# EAGLE design ball_catch_sensor_1 (EAGLE 9.6.2)
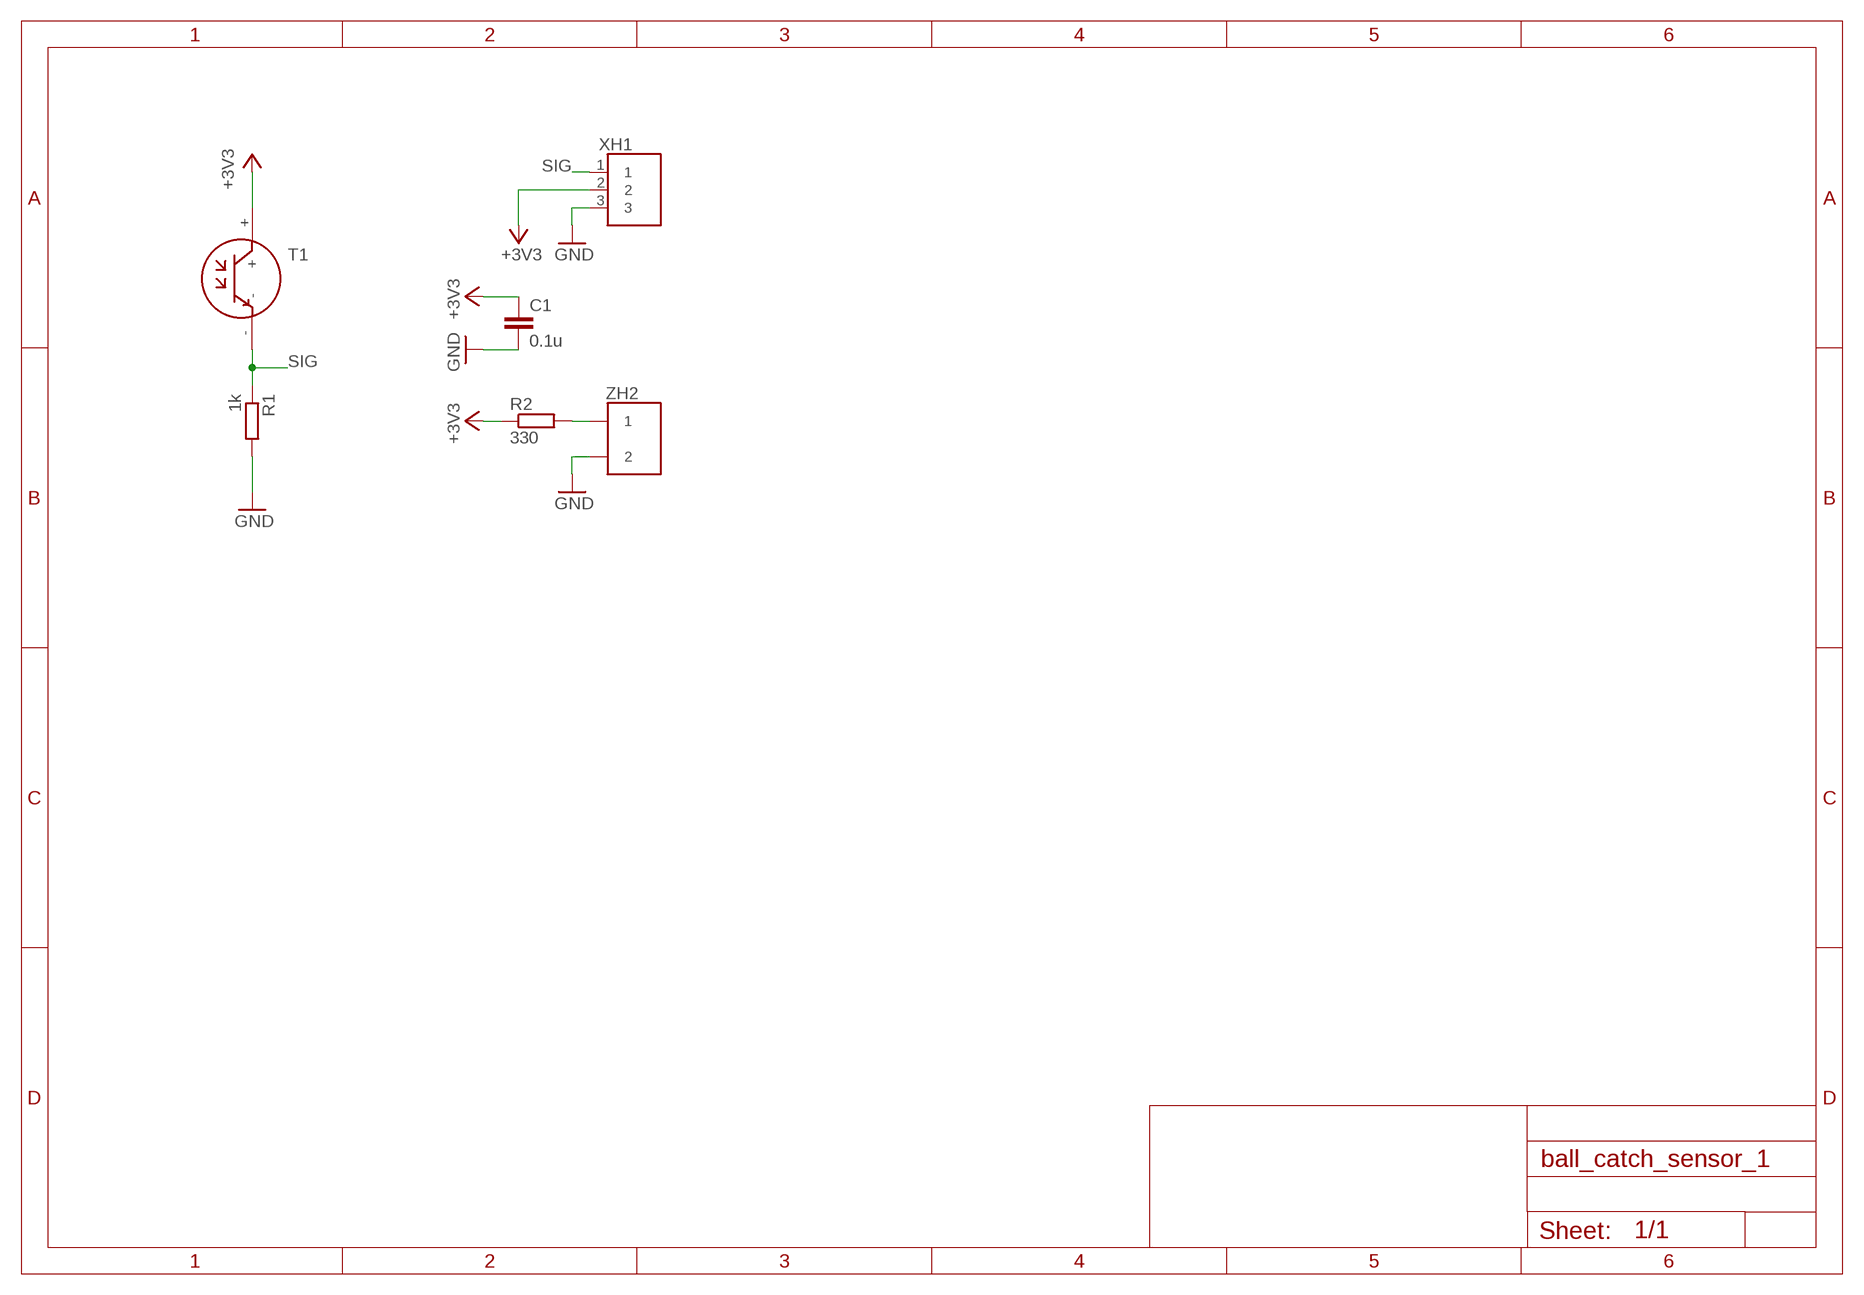
[diagram p0: schematic, sheet 1]

## Parts
C1  0.1u  C-EUC0603  [C0603]
R1  1k  R-EU_0207/10  [0207/10]
R2  330  R-EU_0207/10  [0207/10]
T1  NJL7302L-F3  [NJL7302L-F3]
XH1  S3B  [S3B]
ZH2  2B  [2B]

## Nets
+3V3: C1.1 R2.1 T1.+ XH1.2
GND: C1.2 R1.2 XH1.3 ZH2.2
N$1: R2.2 ZH2.1
SIG: R1.1 T1.- XH1.1

## Library data of the parts
C1 = rcl:C-EU: CAPACITOR, European symbol; SPICEPREFIX: C
R1 R2 = rcl:R-EU_: RESISTOR, European symbol; SPICEPREFIX: R
T1 = NJL7302L-F3:NJL7302L-F3
XH1 = XH:S3B
ZH2 = ZH:2B

## Board
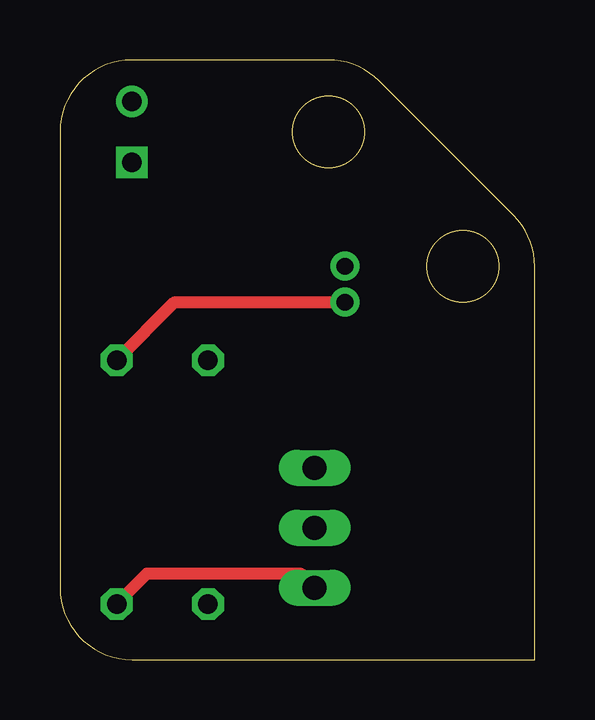
[diagram p1: board, top side]
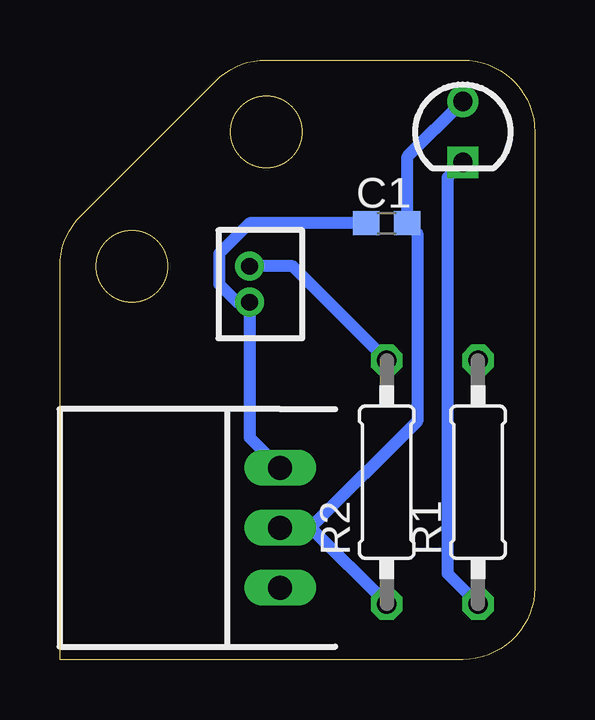
[diagram p2: board, bottom side, seen from below]

Size 19.8 x 25 mm. Coordinates in mm from the lower left corner, seen from the top.
Outline: 0,3 arc90 3,0 19.8,0 19.8,16.39 arc45 18.92,18.51 13.31,24.12 arc45 11.19,25 3,25 arc90 0,22 0,3
Outline: circle at 11.19,22 radius 1.5
Outline: circle at 16.8,16.39 radius 1.5
Copper layers (1*16): Top 0.035mm / dielectric 1.5mm / Bottom 0.035mm
Design rules "default": minimum track width 6mil, minimum drill 0.35mm, track to track 6mil, track to pad 6mil, pad to pad 6mil, via to via 6mil, smd to smd 6mil, copper to edge 40mil, drill to drill 6mil, minimum pad ring 10mil, minimum via ring 8mil, stop-mask expansion 4mil, vias tented up to drill 0mil, thermal gap 10mil

### Footprints (pad centres in the part's own frame; a part is rotated, then mirrored left to right if it is on the bottom)
C0603 = smd 1.1 x 1: 1 -0.85,0; 2 0.85,0
0207/10 = drill 0.813 octagon: 1 -5.08,0; 2 5.08,0
NJL7302L-F3 = drill 0.8: + 1.27,0 | drill 0.8 square: - -1.27,0
S3B = drill 1 long: 1 0,2.5; 2 0,0; 3 0,-2.5
2B = drill 0.7: 1 0,0.75; 2 0,-0.75

### Placement (x,y rotation side)
C1  6.17,18.19 180 bottom
R1  2.37,7.39 90 bottom
R2  6.17,7.39 90 bottom
T1  3,22 90 bottom
XH1  10.62,5.49 180 bottom
ZH2  11.89,15.65 0 bottom

### Tracks (layer width: path | path; a pad name or v marks a point on that pad's centre or on a via)
+3V3
  Bottom 0.5: R2.1 9.35,5.49 | 9.35,5.49 XH1.2 | T1.+ 5.33,20.95 C1.1 4.91,17.77 4.91,9.94 9.35,5.49
GND
  Top 0.5: R1.2 4.79,14.9 ZH2.2
  Bottom 0.5: C1.2 11.89,18.19 13.16,16.92 13.16,15.65 12.41,14.9 ZH2.2 11.89,9.26 XH1.3
N$1
  Bottom 0.5: R2.2 10.1,16.4 ZH2.1
SIG
  Top 0.5: R1.1 3.63,3.59 10.03,3.59 XH1.1
  Bottom 0.5: T1.- 3.63,20.09 3.63,3.59 R1.1